# EAGLE design Flodar_Board (EAGLE 9.5.1)
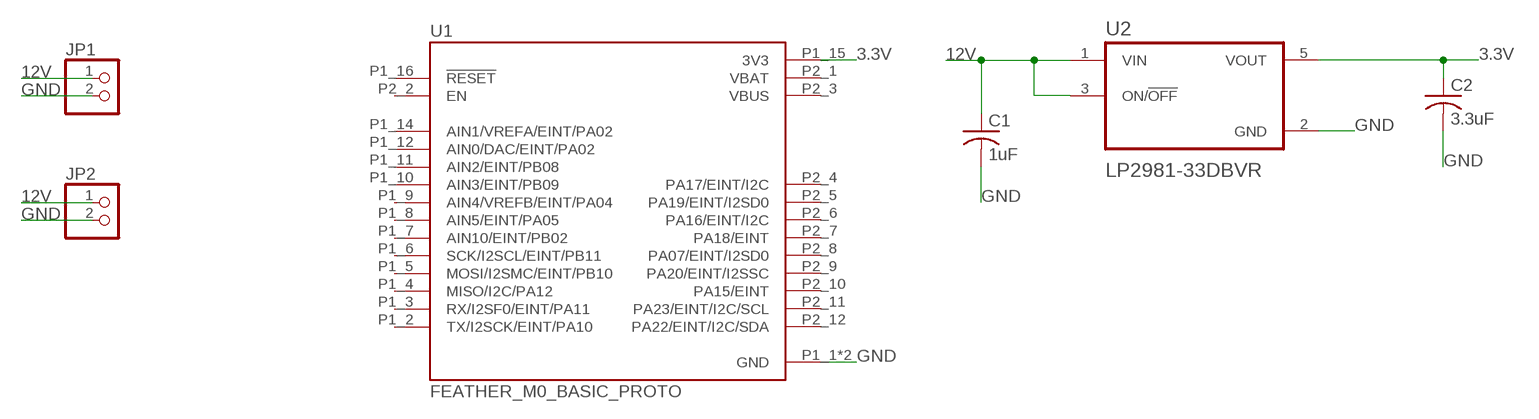
[diagram p0: schematic, sheet 1]

## Parts
C1  1uF  C-USC1206  [C1206]
C2  3.3uF  C-USC1206  [C1206]
JP1  PINHD-1X2  [1X02]
JP2  PINHD-1X2  [1X02]
U1  FEATHER_M0_BASIC_PROTO  [MODULE_FEATHER_M0_BASIC_PROTO]
U2  LP2981-33DBVR  LP2981-50DBVR  [SOT95P280X145-5N]

## Nets
3.3V: C2.1 U1.P1_15(3V3) U2.5(VOUT)
12V: C1.1 JP1.1 JP2.1 U2.1(VIN) U2.3(ON/!OFF)
GND: C1.2 C2.2 JP1.2 JP2.2 U1.P1_1(GND) U1.P1_13(GND) U2.2(GND)
Unconnected: U1.P1_2(TX/I2SCK/EINT/PA10) U1.P1_3(RX/I2SF0/EINT/PA11) U1.P1_4(MISO/I2C/PA12) U1.P1_5(MOSI/I2SMC/EINT/PB10) U1.P1_6(SCK/I2SCL/EINT/PB11) U1.P1_7(AIN10/EINT/PB02) U1.P1_8(AIN5/EINT/PA05) U1.P1_9(AIN4/VREFB/EINT/PA04) U1.P1_10(AIN3/EINT/PB09) U1.P1_11(AIN2/EINT/PB08) U1.P1_12(AIN0/DAC/EINT/PA02) U1.P1_14(AIN1/VREFA/EINT/PA02) U1.P1_16(!RESET) U1.P2_2(EN) U1.P2_4(PA17/EINT/I2C) U1.P2_5(PA19/EINT/I2SD0) U1.P2_6(PA16/EINT/I2C) U1.P2_7(PA18/EINT) U1.P2_8(PA07/EINT/I2SD0) U1.P2_9(PA20/EINT/I2SSC) U1.P2_10(PA15/EINT) U1.P2_11(PA23/EINT/I2C/SCL) U1.P2_12(PA22/EINT/I2C/SDA)

## Power pins joined to a net without a drawn wire
VBAT: U1.P2_1(VBAT)
VBUS: U1.P2_3(VBUS)

## Library data of the parts
C1 C2 = rcl:C-US: CAPACITOR, American symbol; SPICEPREFIX: C
JP1 JP2 = pinhead:PINHD-1X2: PIN HEADER
U1 = FEATHER_M0_BASIC_PROTO:FEATHER_M0_BASIC_PROTO: ATSAMD21G18 Feather M0 Basic Proto SAM D ARM® Cortex®-M0+ MCU 32-Bit Embedded Evaluation Board Check prices <https://pricing.snapeda.com/parts/Feather%20M0%20Basic%20Proto/Adafruit%20Industries/view-part?ref=eda>; AVAILABILITY: No availability data; DESCRIPTION: ATSAMD21G18 Feather M0 Basic Proto SAM D ARM® Cortex®-M0+ MCU 32-Bit Embedded Evaluation Board; MF: Adafruit Industries; MP: Feather M0 Basic Proto; PACKAGE: Package; PRICE: None
U2 = LP2981-33DBVR:LP2981-50DBVR: Check prices <https://pricing.snapeda.com/parts/LP2981-50DBVR/Texas%20Instruments/view-part?ref=eda>; AVAILABILITY: In Stock; DESCRIPTION: 100-mA, 16-V, low-dropout voltage regulator with enable 5-SOT-23 -40 to 125; MF: Texas Instruments; MP: LP2981-50DBVR; PACKAGE: SOT-23-5 Texas Instruments; PRICE: None; PURCHASE-URL: https://pricing.snapeda.com/search/part/LP2981-50DBVR/?ref=eda

## Board
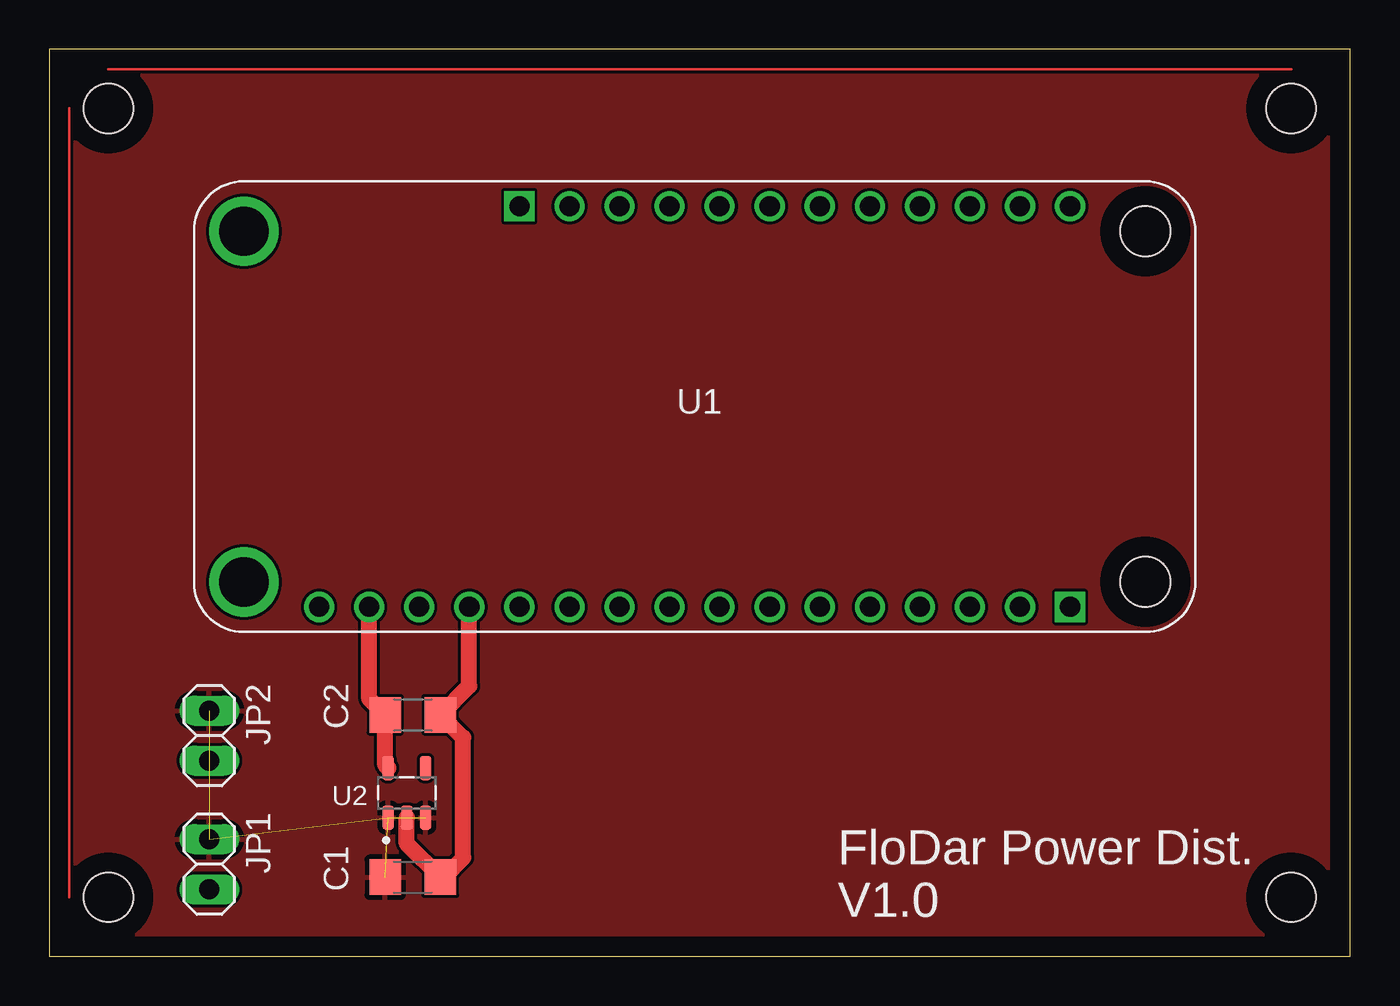
[diagram p1: board, top side]
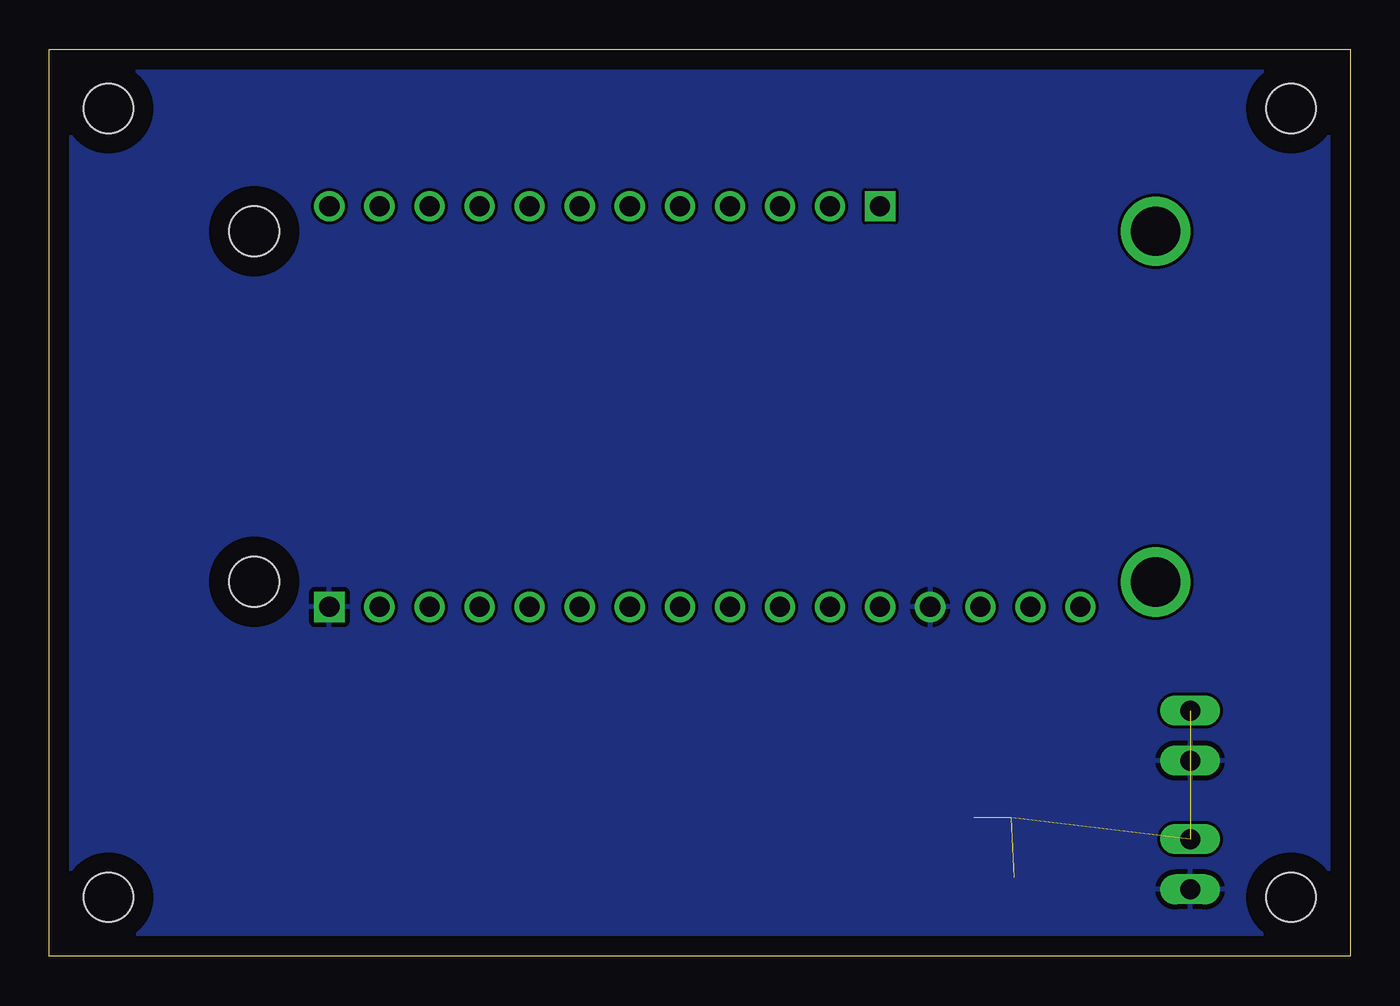
[diagram p2: board, bottom side, seen from below]

Size 66 x 46 mm. Coordinates in mm from the lower left corner, seen from the top.
Outline: 0,0 66,0 66,46 0,46 0,0
Copper layers (1*16): Top 0.035mm / dielectric 1.5mm / Bottom 0.035mm
Design rules "default": minimum track width 6mil, minimum drill 0.35mm, track to track 6mil, track to pad 6mil, pad to pad 6mil, via to via 6mil, smd to smd 6mil, copper to edge 40mil, drill to drill 6mil, minimum pad ring 10mil, minimum via ring 8mil, stop-mask expansion 4mil, vias tented up to drill 0mil, thermal gap 10mil
Holes 2.5 mm at 63,3 63,43 3,43 3,3

### Footprints (pad centres in the part's own frame; a part is rotated, then mirrored left to right if it is on the bottom)
C1206 = smd 1.6 x 1.8: 1 -1.4,0; 2 1.4,0
1X02 = drill 1.016 long: 1 -1.27,0; 2 1.27,0
MODULE_FEATHER_M0_BASIC_PROTO = drill 1.02 square: P1_1 19.05,-10.16; P2_1 -8.89,10.16 | drill 1.02: P1_2 16.51,-10.16; P1_3 13.97,-10.16; P1_4 11.43,-10.16; P1_5 8.89,-10.16; P1_6 6.35,-10.16; P1_7 3.81,-10.16; P1_8 1.27,-10.16; P1_9 -1.27,-10.16; P1_10 -3.81,-10.16; P1_11 -6.35,-10.16; P1_12 -8.89,-10.16; P1_13 -11.43,-10.16; P1_14 -13.97,-10.16; P1_15 -16.51,-10.16; P1_16 -19.05,-10.16; P2_2 -6.35,10.16; P2_3 -3.81,10.16; P2_4 -1.27,10.16; P2_5 1.27,10.16; P2_6 3.81,10.16; P2_7 6.35,10.16; P2_8 8.89,10.16; P2_9 11.43,10.16; P2_10 13.97,10.16; P2_11 16.51,10.16; P2_12 19.05,10.16 | drill 2.5 pad 3.2: P$1 -22.86,8.89; P$2 -22.86,-8.89 | hole 2.54: 22.86,-8.89; 22.86,8.89
SOT95P280X145-5N = smd 1.21 x 0.59: 1 -1.255,0.95; 2 -1.255,0; 3 -1.255,-0.95; 4 1.255,-0.95; 5 1.255,0.95

### Placement (x,y rotation side)
C1  18.44,4.02 0 top
C2  18.44,12.25 0 top
JP1  8.12,4.67 270 top
JP2  8.12,11.19 270 top
U1  32.74,27.88 0 top
U2  18.14,8.29 90 top

### Tracks (layer width: path | path; a pad name or v marks a point on that pad's centre or on a via)
3.3V
  Top 0.813: U2.5 17.04,9.7 C2.1 16.23,13.06 U1.P1_15
12V  (4 unrouted)
  pour Top: 66,46 0,46 0,0 66,0
GND
  Top 0.813: U2.2 18.14,5.72 C1.2 20.02,4.02 21,5 21,11.09 C2.2 21.31,13.72 U1.P1_13
  pour Bottom: 0,46 0,0 66,0 66,46
(copper drawn outside any net)
  shapes: Top area x2

### Text on the board
tNames: FloDar Power Dist. / V1.0